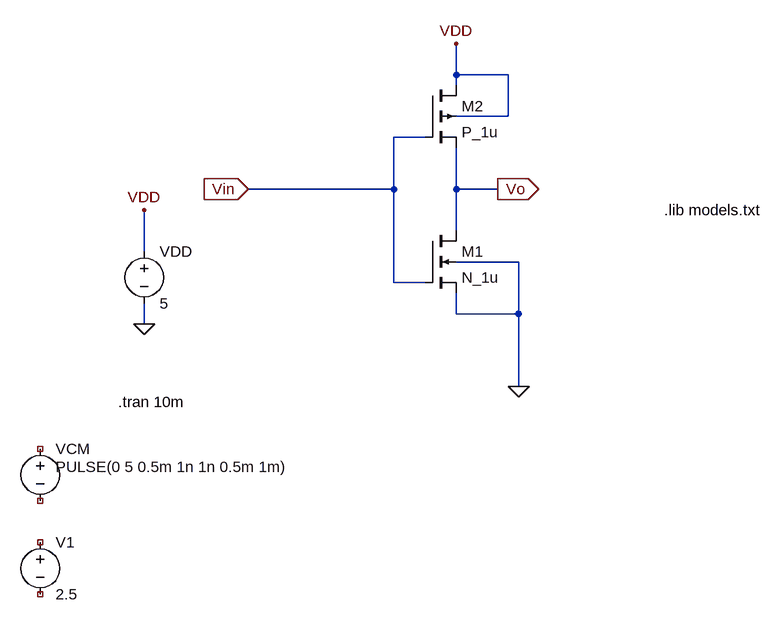
[diagram p0: schematic TP1.asc]
TP1.asc, the LTspice schematic file:
Version 4.1
SHEET 1 1088 704
WIRE 544 -112 544 -160
WIRE 624 -112 544 -112
WIRE 544 -96 544 -112
WIRE 624 -48 624 -112
WIRE 624 -48 544 -48
WIRE 496 -16 448 -16
WIRE 448 64 448 -16
WIRE 448 64 224 64
WIRE 544 64 544 0
WIRE 608 64 544 64
WIRE 544 128 544 64
WIRE 64 160 64 96
WIRE 640 176 544 176
WIRE 448 208 448 64
WIRE 496 208 448 208
WIRE 544 256 544 224
WIRE 640 256 640 176
WIRE 640 256 544 256
WIRE 64 272 64 240
WIRE 640 368 640 256
FLAG 64 272 0
FLAG 64 96 VDD
FLAG 224 64 Vin
IOPIN 224 64 In
FLAG 640 368 0
FLAG 544 -160 VDD
FLAG 608 64 Vo
IOPIN 608 64 Out
SYMBOL voltage 64 144 R0
SYMATTR InstName VDD
SYMATTR Value 5
SYMBOL voltage -96 448 R0
WINDOW 123 24 92 Left 2
WINDOW 39 0 0 Left 0
WINDOW 3 24 44 Left 2
SYMATTR Value PULSE(0 5 0.5m 1n 1n 0.5m 1m)
SYMATTR InstName VCM
SYMBOL nmos4 496 128 R0
SYMATTR InstName M1
SYMATTR Value N_1u
SYMATTR Value2 l=1u w=2u
SYMBOL pmos4 496 -96 R0
SYMATTR InstName M2
SYMATTR Value2 l=1u w=4.83u
SYMATTR Value P_1u
SYMBOL voltage -96 592 R0
SYMATTR InstName V1
SYMATTR Value 2.5
TEXT 864 96 Left 2 !.lib models.txt
TEXT 24 392 Left 2 !.tran 10m

The netlist it stands for:
* TP1.asc
VDD VDD 0 5
VCM NC_01 NC_02 PULSE(0 5 0.5m 1n 1n 0.5m 1m)
M1 Vo Vin 0 0 N_1u l=1u w=2u
M2 VDD Vin Vo VDD P_1u l=1u w=4.83u
V1 NC_03 NC_04 2.5
.model NMOS NMOS
.model PMOS PMOS
.lib standard.mos
.lib models.txt
.tran 10m
.backanno
.end